# EAGLE design cytron (EAGLE 9.3.1)
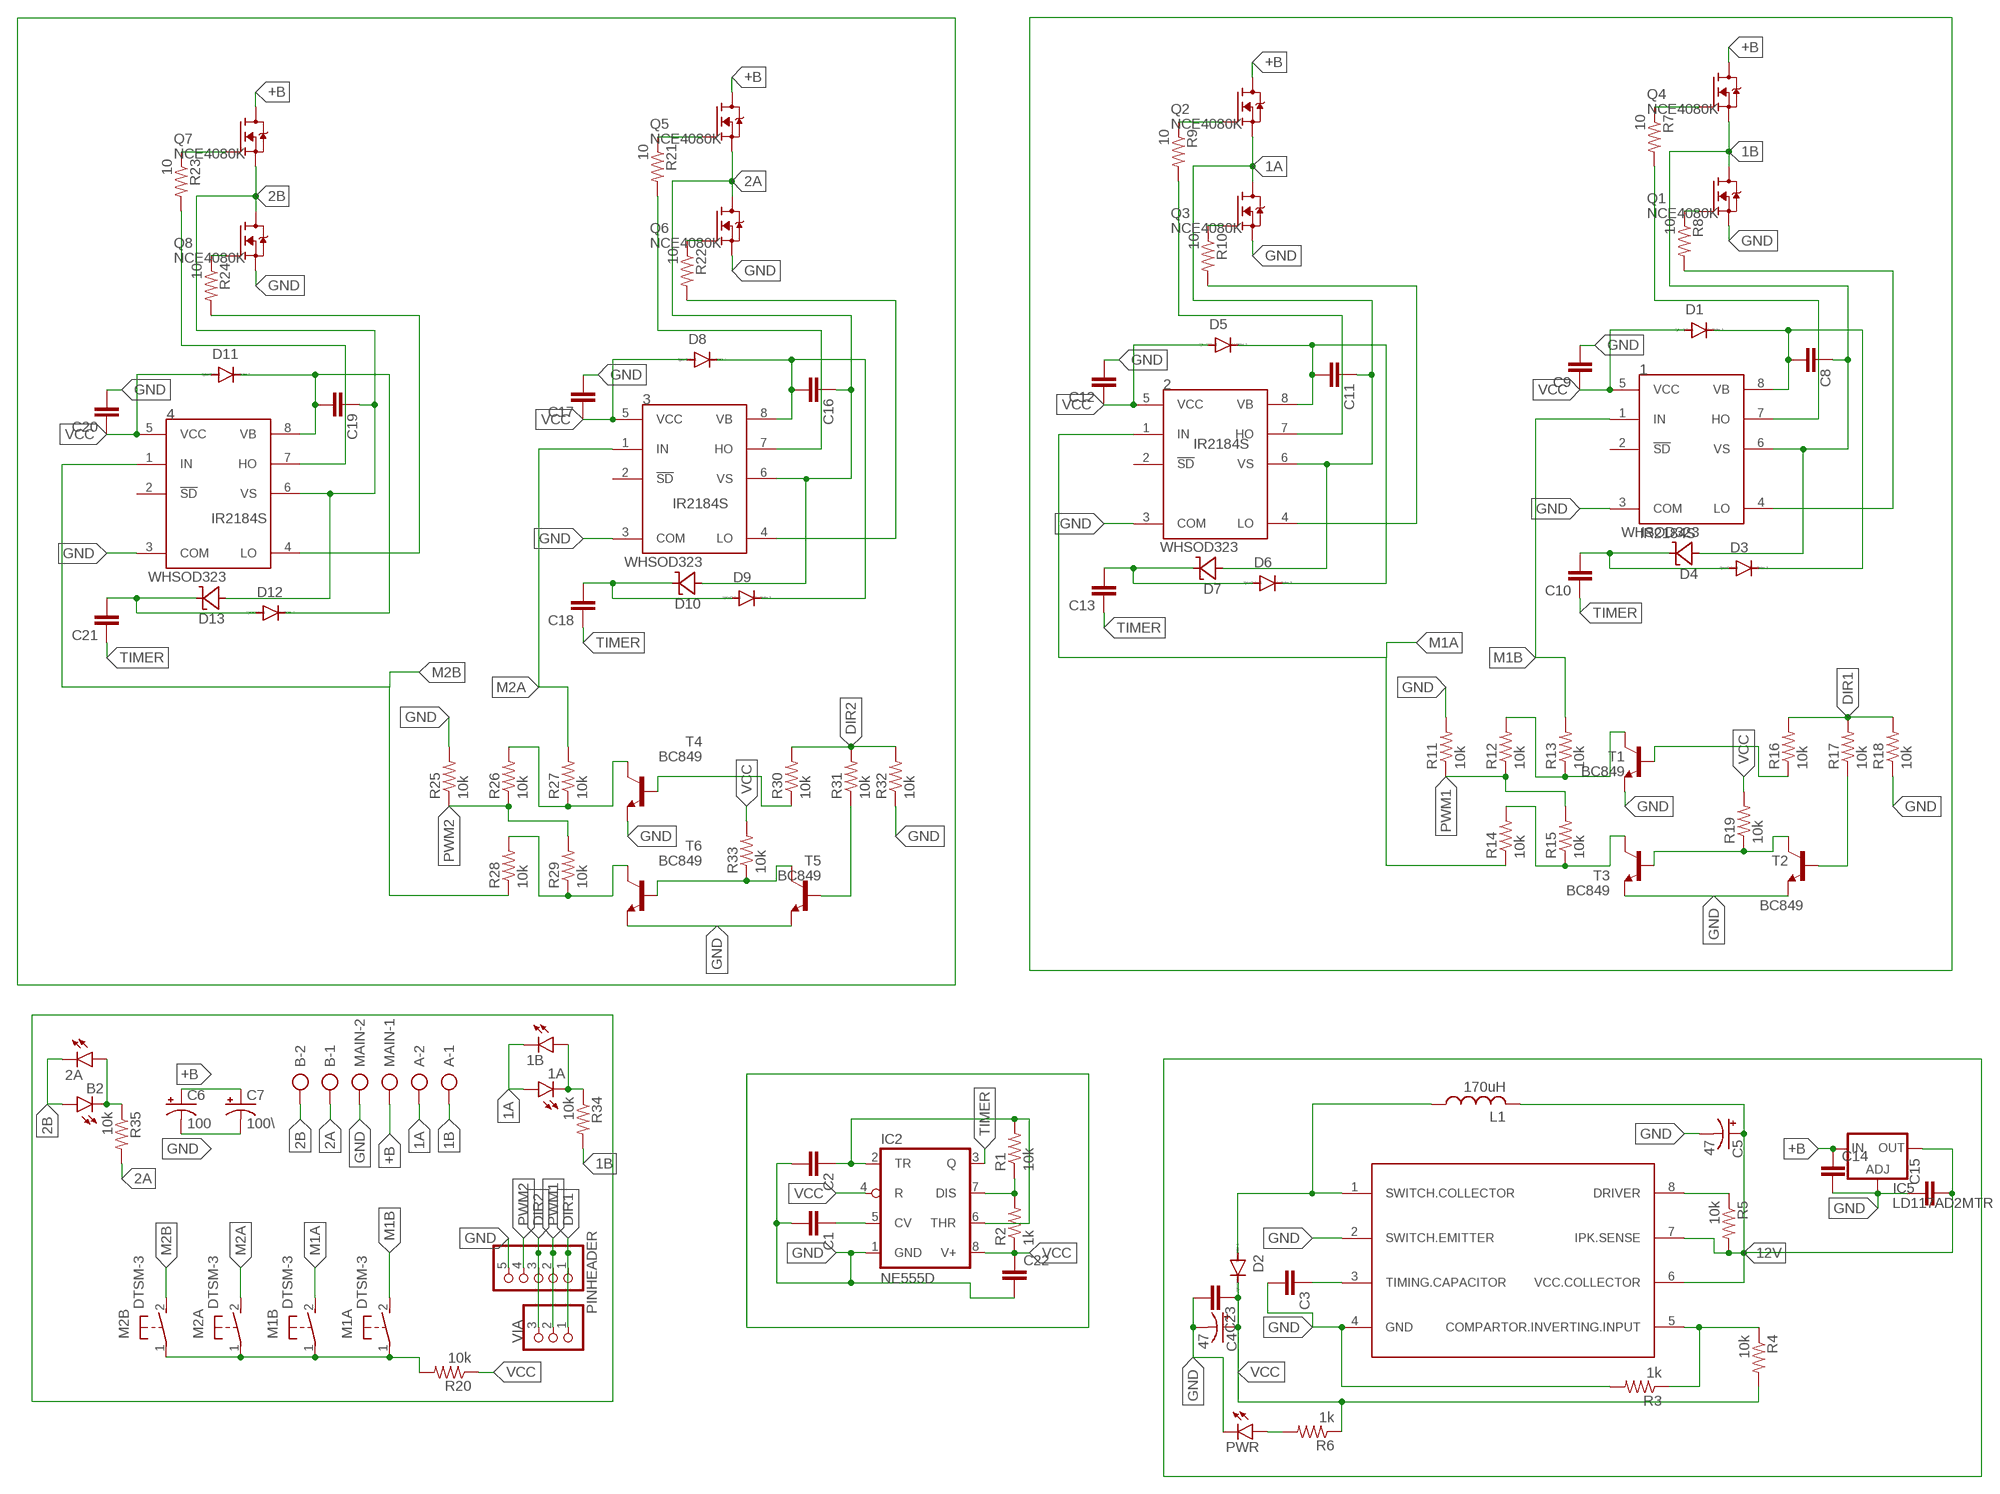
[diagram p0: schematic, sheet 1]

## Parts
1  IR2184S  [SO08]
1A  LEDCHIPLED_1206  [CHIPLED_1206]
1B  LEDCHIPLED_1206  [CHIPLED_1206]
2  IR2184S  [SO08]
2A  LEDCHIPLED_1206  [CHIPLED_1206]
3  IR2184S  [SO08]
4  IR2184S  [SO08]
A  AK300/22  [XTALRR488W60L1090T465H350B]
B  AK300/22  [XTALRR488W60L1090T465H350B]
B2  LEDCHIPLED_1206  [CHIPLED_1206]
C1  C-EUC0805K  [C0805K]
C2  C-EUC0805K  [C0805K]
C3  C-EUC0805K  [C0805K]
C4  47  CPOL-US140CLH-1014  [140CLH-1014]
C5  47  CPOL-US140CLH-1014  [140CLH-1014]
C6  100  CPOL-USSANYO_SMD_F12  [SANYO-OSCON_SMD_F12]
C7  100\  CPOL-USSANYO_SMD_F12  [SANYO-OSCON_SMD_F12]
C8  C-EUC0805K  [C0805K]
C9  C-EUC0805K  [C0805K]
C10  C-EUC0805K  [C0805K]
C11  C-EUC0805K  [C0805K]
C12  C-EUC0805K  [C0805K]
C13  C-EUC0805K  [C0805K]
C14  C-EUC0805K  [C0805K]
C15  C-EUC0805K  [C0805K]
C16  C-EUC0805K  [C0805K]
C17  C-EUC0805K  [C0805K]
C18  C-EUC0805K  [C0805K]
C19  C-EUC0805K  [C0805K]
C20  C-EUC0805K  [C0805K]
C21  C-EUC0805K  [C0805K]
C22  C-EUC0805K  [C0805K]
C23  C-EUC0805K  [C0805K]
D1  DIODE-SMB  [SMB]
D2  DIODE-SMB  [SMB]
D3  DIODE-SMB  [SMB]
D4  WHSOD323  [SOD323-W]
D5  DIODE-SMB  [SMB]
D6  DIODE-SMB  [SMB]
D7  WHSOD323  [SOD323-W]
D8  DIODE-SMB  [SMB]
D9  DIODE-SMB  [SMB]
D10  WHSOD323  [SOD323-W]
D11  DIODE-SMB  [SMB]
D12  DIODE-SMB  [SMB]
D13  WHSOD323  [SOD323-W]
IC2  NE555D  [SO08]
IC5  LD117AD2MTR  [D2PACK]
L1  170uH  L-USWE-TPC  [POWER-CHOKE_WE-TPC]
M1A  DTSM-3  [DTSM-3]
M1B  DTSM-3  [DTSM-3]
M2A  DTSM-3  [DTSM-3]
M2B  DTSM-3  [DTSM-3]
MAIN  AK300/22  [XTALRR488W60L1090T465H350B]
PINHEADER  PINHD-1X5  [1X05]
PWR  LEDCHIPLED_1206  [CHIPLED_1206]
Q1  NCE4080K  [TO252]
Q2  NCE4080K  [TO252]
Q3  NCE4080K  [TO252]
Q4  NCE4080K  [TO252]
Q5  NCE4080K  [TO252]
Q6  NCE4080K  [TO252]
Q7  NCE4080K  [TO252]
Q8  NCE4080K  [TO252]
R1  10k  R-US_R1206  [R1206]
R2  1k  R-US_R1206  [R1206]
R3  1k  R-US_R1206  [R1206]
R4  10k  R-US_R1206  [R1206]
R5  10k  R-US_R1206  [R1206]
R6  1k  R-US_R1206  [R1206]
R7  10  R-US_R1206  [R1206]
R8  10  R-US_R1206  [R1206]
R9  10  R-US_R1206  [R1206]
R10  10  R-US_R1206  [R1206]
R11  10k  R-US_R1206  [R1206]
R12  10k  R-US_R1206  [R1206]
R13  10k  R-US_R1206  [R1206]
R14  10k  R-US_R1206  [R1206]
R15  10k  R-US_R1206  [R1206]
R16  10k  R-US_R1206  [R1206]
R17  10k  R-US_R1206  [R1206]
R18  10k  R-US_R1206  [R1206]
R19  10k  R-US_R1206  [R1206]
R20  10k  R-US_R1206  [R1206]
R21  10  R-US_R1206  [R1206]
R22  10  R-US_R1206  [R1206]
R23  10  R-US_R1206  [R1206]
R24  10  R-US_R1206  [R1206]
R25  10k  R-US_R1206  [R1206]
R26  10k  R-US_R1206  [R1206]
R27  10k  R-US_R1206  [R1206]
R28  10k  R-US_R1206  [R1206]
R29  10k  R-US_R1206  [R1206]
R30  10k  R-US_R1206  [R1206]
R31  10k  R-US_R1206  [R1206]
R32  10k  R-US_R1206  [R1206]
R33  10k  R-US_R1206  [R1206]
R34  10k  R-US_R1206  [R1206]
R35  10k  R-US_R1206  [R1206]
T1  BC849  [SOT23]
T2  BC849  [SOT23]
T3  BC849  [SOT23]
T4  BC849  [SOT23]
T5  BC849  [SOT23]
T6  BC849  [SOT23]
U$1  AB34063  [SO8]
VIA  PINHD-1X3  [1X03]

## Nets
1A: 1A.A 1B.C 2.6(VS) A.2 C11.1 D7.A Q2.2(S) Q3.3(D)
1B: 1.6(VS) A.1 C8.1 D4.A Q1.3(D) Q4.2(S) R34.2
2A: 3.6(VS) B.1 C16.1 D10.A Q5.2(S) Q6.3(D) R35.2
2B: 2A.C 4.6(VS) B2.A B.2 C19.1 D13.A Q7.2(S) Q8.3(D)
12V: C5.+ C15.2 IC5.3(OUT) L1.2 R5.2 U$1.6(VCC.COLLECTOR) U$1.7(IPK.SENSE)
+B: C6.+ C7.+ C14.1 IC5.1(IN) MAIN.1 Q2.3(D) Q4.3(D) Q5.3(D) Q7.3(D)
DIR1: PINHEADER.1 R16.2 R17.2 R18.2 VIA.1
DIR2: PINHEADER.3 R30.2 R31.2 R32.2 VIA.3
GND: 1.3(COM) 2.3(COM) 3.3(COM) 4.3(COM) C1.2 C2.2 C3.2 C4.- C5.- C6.- C7.- C9.2 C12.2 C14.2 C15.1 C17.2 C20.2 C22.2 C23.2 IC2.1(GND) IC5.2(ADJ) MAIN.2 PINHEADER.5 PWR.C Q1.2(S) Q3.2(S) Q6.2(S) Q8.2(S) R3.2 R11.2 R18.1 R25.2 R32.1 T1.2(E) T2.2(E) T3.2(E) T4.2(E) T5.2(E) T6.2(E) U$1.2(SWITCH.EMITTER) U$1.4(GND)
M1A: 2.1(IN) M1B.2 R14.1
M1B: 1.1(IN) M1A.2 R13.2
M2A: 3.1(IN) M2A.2 R27.2
M2B: 4.1(IN) M2B.2 R28.1
N$1: PWR.A R6.2
N$2: C1.1 IC2.5(CV)
N$3: IC2.7(DIS) R1.1 R2.2
N$4: C2.1 IC2.2(TR) IC2.6(THR) R1.2
N$5: C3.1 U$1.3(TIMING.CAPACITOR)
N$6: Q6.1(G) R22.1
N$7: D2.A L1.1 U$1.1(SWITCH.COLLECTOR)
N$8: R5.1 U$1.8(DRIVER)
N$9: Q4.1(G) R7.1
N$10: Q1.1(G) R8.1
N$11: R3.1 R4.1 U$1.5(COMPARTOR.INVERTING.INPUT)
N$12: 1.4(LO) R8.2
N$13: 1.7(HO) R7.2
N$14: C10.2 D3.A D4.C
N$15: Q3.1(G) R10.1
N$16: Q2.1(G) R9.1
N$17: 2.4(LO) R10.2
N$18: 2.7(HO) R9.2
N$19: R16.1 T1.1(B)
N$20: C13.2 D6.A D7.C
N$21: M1A.1 M1B.1 M2A.1 M2B.1 R20.2
N$22: R14.2 R15.1 T3.3(C)
N$24: R12.2 R13.1 T1.3(C)
N$25: Q5.1(G) R21.1
N$26: 3.4(LO) R22.2
N$27: R19.1 T2.3(C) T3.1(B)
N$28: R17.1 T2.1(B)
N$30: 3.7(HO) R21.2
N$31: C18.2 D9.A D10.C
N$32: Q8.1(G) R24.1
N$33: Q7.1(G) R23.1
N$34: 4.4(LO) R24.2
N$35: 4.7(HO) R23.2
N$36: C21.2 D12.A D13.C
N$37: R28.2 R29.1 T6.3(C)
N$38: R26.2 R27.1 T4.3(C)
N$39: R30.1 T4.1(B)
N$40: R33.1 T5.3(C) T6.1(B)
N$41: R31.1 T5.1(B)
N$45: 1A.C 1B.A R34.1
N$46: 2A.A B2.C R35.1
PWM1: PINHEADER.2 R11.1 R12.1 R15.2 VIA.2
PWM2: PINHEADER.4 R25.1 R26.1 R29.2
TIMER: C10.1 C13.1 C18.1 C21.1 IC2.3(Q)
VB1: 1.8(VB) C8.2 D1.C D3.C
VB2: 2.8(VB) C11.2 D5.C D6.C
VB3: 3.8(VB) C16.2 D8.C D9.C
VB4: 4.8(VB) C19.2 D11.C D12.C
VCC: 1.5(VCC) 2.5(VCC) 3.5(VCC) 4.5(VCC) C4.+ C9.1 C12.1 C17.1 C20.1 C22.1 C23.1 D1.A D2.C D5.A D8.A D11.A IC2.4(R) IC2.8(V+) R2.1 R4.2 R6.1 R19.2 R20.1 R33.2
Unconnected: 1.2(!SD) 2.2(!SD) 3.2(!SD) 4.2(!SD)

## Library data of the parts
1-4 = irs:IR2184
1A 1B 2A B2 PWR = led:LED: LED OSRAM: - CHIPLED LG R971, LG N971, LY N971, LG Q971, LY Q971, LO R971, LY R971 LH N974, LH R974 LS Q976, LO Q976, LY Q976 LO Q996 - Hyper CHIPLED LW Q18S LB Q993, LB Q99A, LB R99A - SideLED LS A670, LO A670, LY A670, LG A670, LP A670 LB A673, LV A673, LT A673, LW A673 LH A674 LY A675 LS A676, LA A676, LO A676, LY A676, LW A676 LS A679, LY A679, LG A679 - Hyper Micro SIDELED® LS Y876, LA Y876, LO Y876, LY Y876 LT Y87S - SmartLED LW L88C, LW L88S LB L89C, LB L89S, LG L890 LS L89K, LO L89K, LY L89K LS L896, LA L896, LO L896, LY L896 - TOPLED LS T670, LO T670, LY T670, LG T670, LP T670 LSG T670, LSP T670, LSY T670, LOP T670, LYG T670 LG T671, LOG T671, LSG T671 LB T673, LV T673, LT T673, LW T673 LH T674 LS T676, LA T676, LO T676, LY T676, LB T676, LH T676, LSB T676, LW T676 LB T67C, LV T67C, LT T67C, LS T67K, LO T67K, LY T67K, LW E67C LS E67B, LA E67B, LO E67B, LY E67B, LB E67C, LV E67C, LT E67C LW T67C LS T679, LY T679, LG T679 LS T770, LO T770, LY T770, LG T770, LP T770 LB T773, LV T773, LT T773, LW T773 LH T774 LS E675, LA E675, LY E675, LS T675 LS T776, LA T776, LO T776, LY T776, LB T776 LHGB T686 LT T68C, LB T68C - Hyper Mini TOPLED® LB M676 - Mini TOPLED Santana® LG M470 LS M47K, LO M47K, LY M47K Source: http://www.osram.convergy.de LUXEON: - LUMILED® LXK2-PW12-R00, LXK2-PW12-S00, LXK2-PW14-U00, LXK2-PW14-V00 LXK2-PM12-R00, LXK2-PM12-S00, LXK2-PM14-U00 LXK2-PE12-Q00, LXK2-PE12-R00, LXK2-PE12-S00, LXK2-PE14-T00, LXK2-PE14-U00 LXK2-PB12-K00, LXK2-PB12-L00, LXK2-PB12-M00, LXK2-PB14-N00, LXK2-PB14-P00, LXK2-PB14-Q00 LXK2-PR12-L00, LXK2-PR12-M00, LXK2-PR14-Q00, LXK2-PR14-R00 LXK2-PD12-Q00, LXK2-PD12-R00, LXK2-PD12-S00 LXK2-PH12-R00, LXK2-PH12-S00 LXK2-PL12-P00, LXK2-PL12-Q00, LXK2-PL12-R00 Source: www.luxeon.com KINGBRIGHT: KA-3528ASYC Source: www.kingbright.com
A B MAIN = con-ptr50056:AK300/2: CONNECTOR
C1-C3 C8-C23 = rcl:C-EU: CAPACITOR, European symbol; SPICEPREFIX: C
C4-C7 = rcl:CPOL-US: POLARIZED CAPACITOR, American symbol; SPICEPREFIX: C
D1-D3 D5 D6 D8 D9 D11 D12 = diode:DIODE-: DIODE
D4 D7 D10 D13 = diode:WH
IC2 = linear:*555: TIMER
IC5 = v-reg:LD117A?*: Low drop fixed and adjustable positive voltage regulators 1 A Source: http://www.st.com/stonline/products/literature/ds/7194/ld1117axx.pdf
L1 = rcl:L-US: INDUCTOR, American symbol; SPICEPREFIX: L
M1A M1B M2A M2B = switch-tact:DTSM-3
PINHEADER = pinhead:PINHD-1X5: PIN HEADER
Q1-Q8 = transistor-fet:NCE4080K
R1-R35 = rcl:R-US_: RESISTOR, American symbol; SPICEPREFIX: R
T1-T6 = transistor-neu-to92:BC849: NPN TRANSISTOR
U$1 = ab34063:AB34063
VIA = pinhead:PINHD-1X3: PIN HEADER

## Board
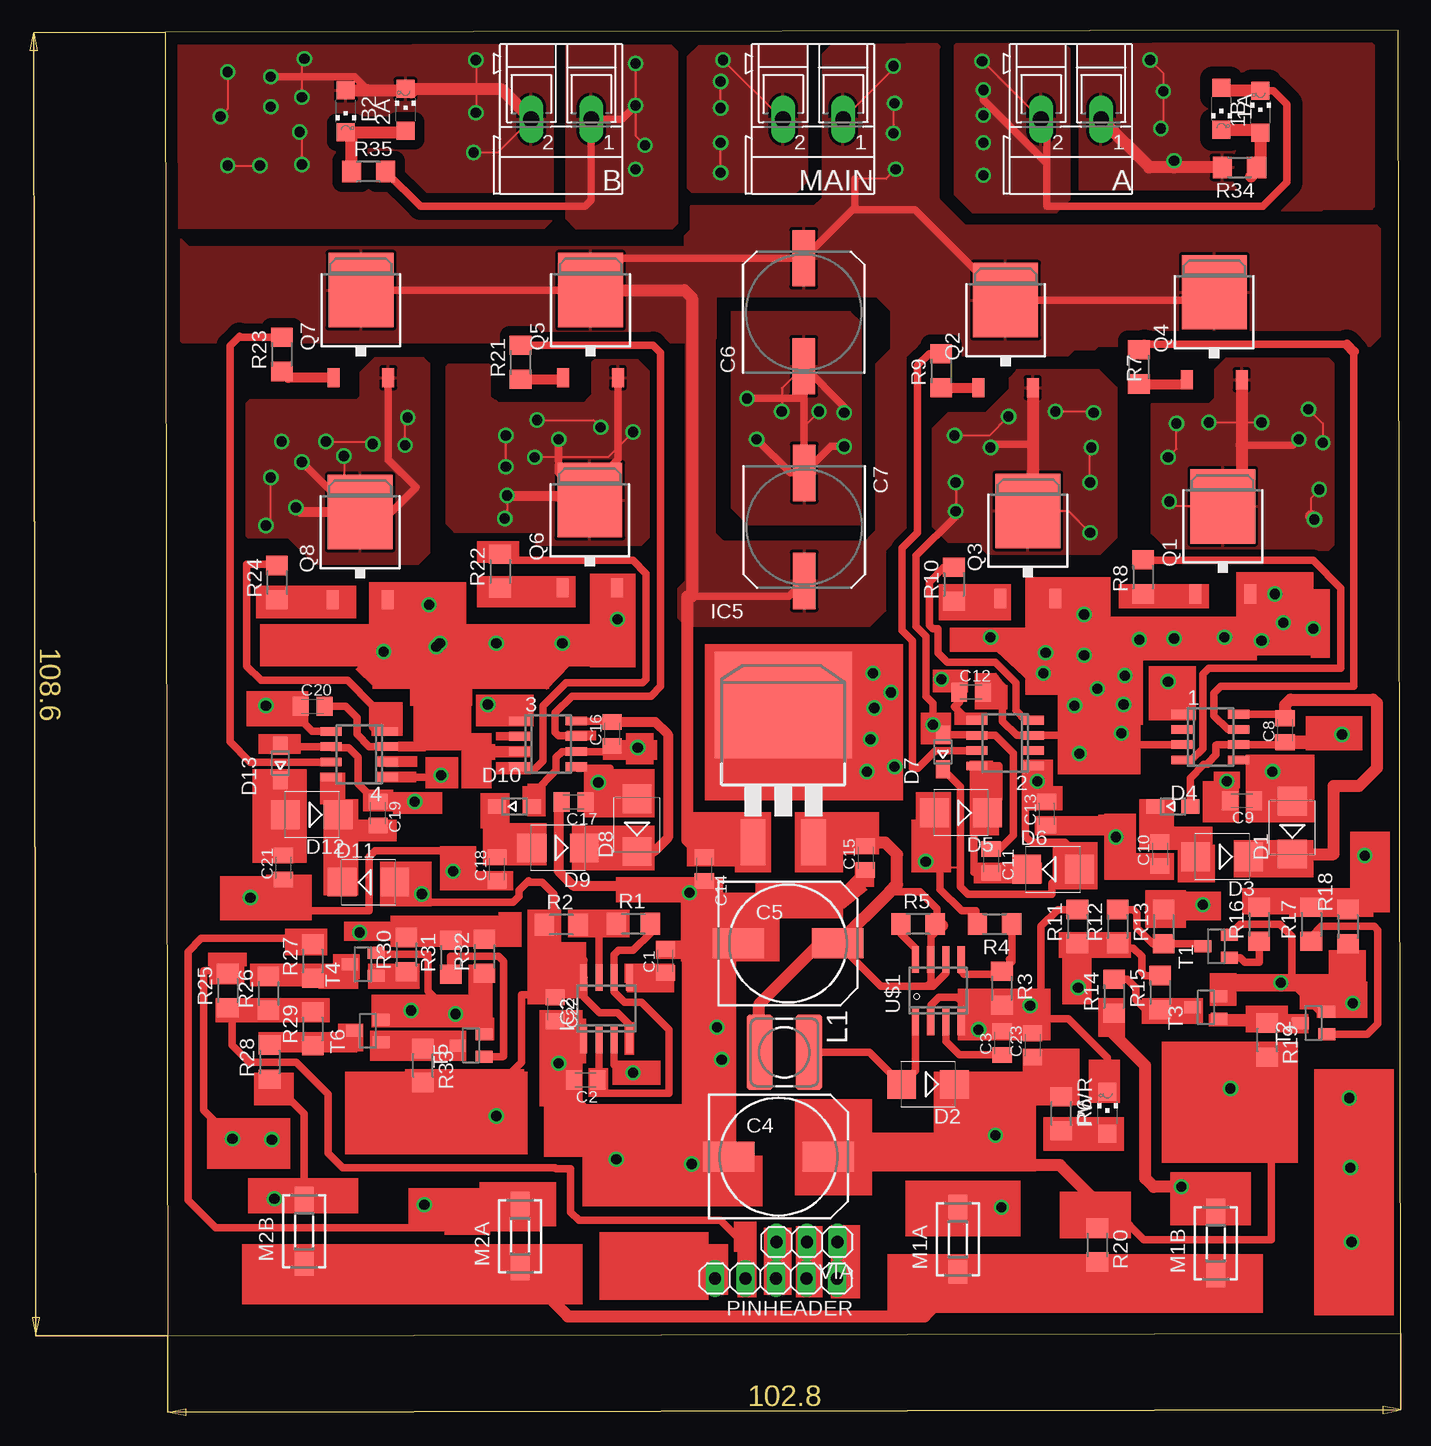
[diagram p1: board, top side]
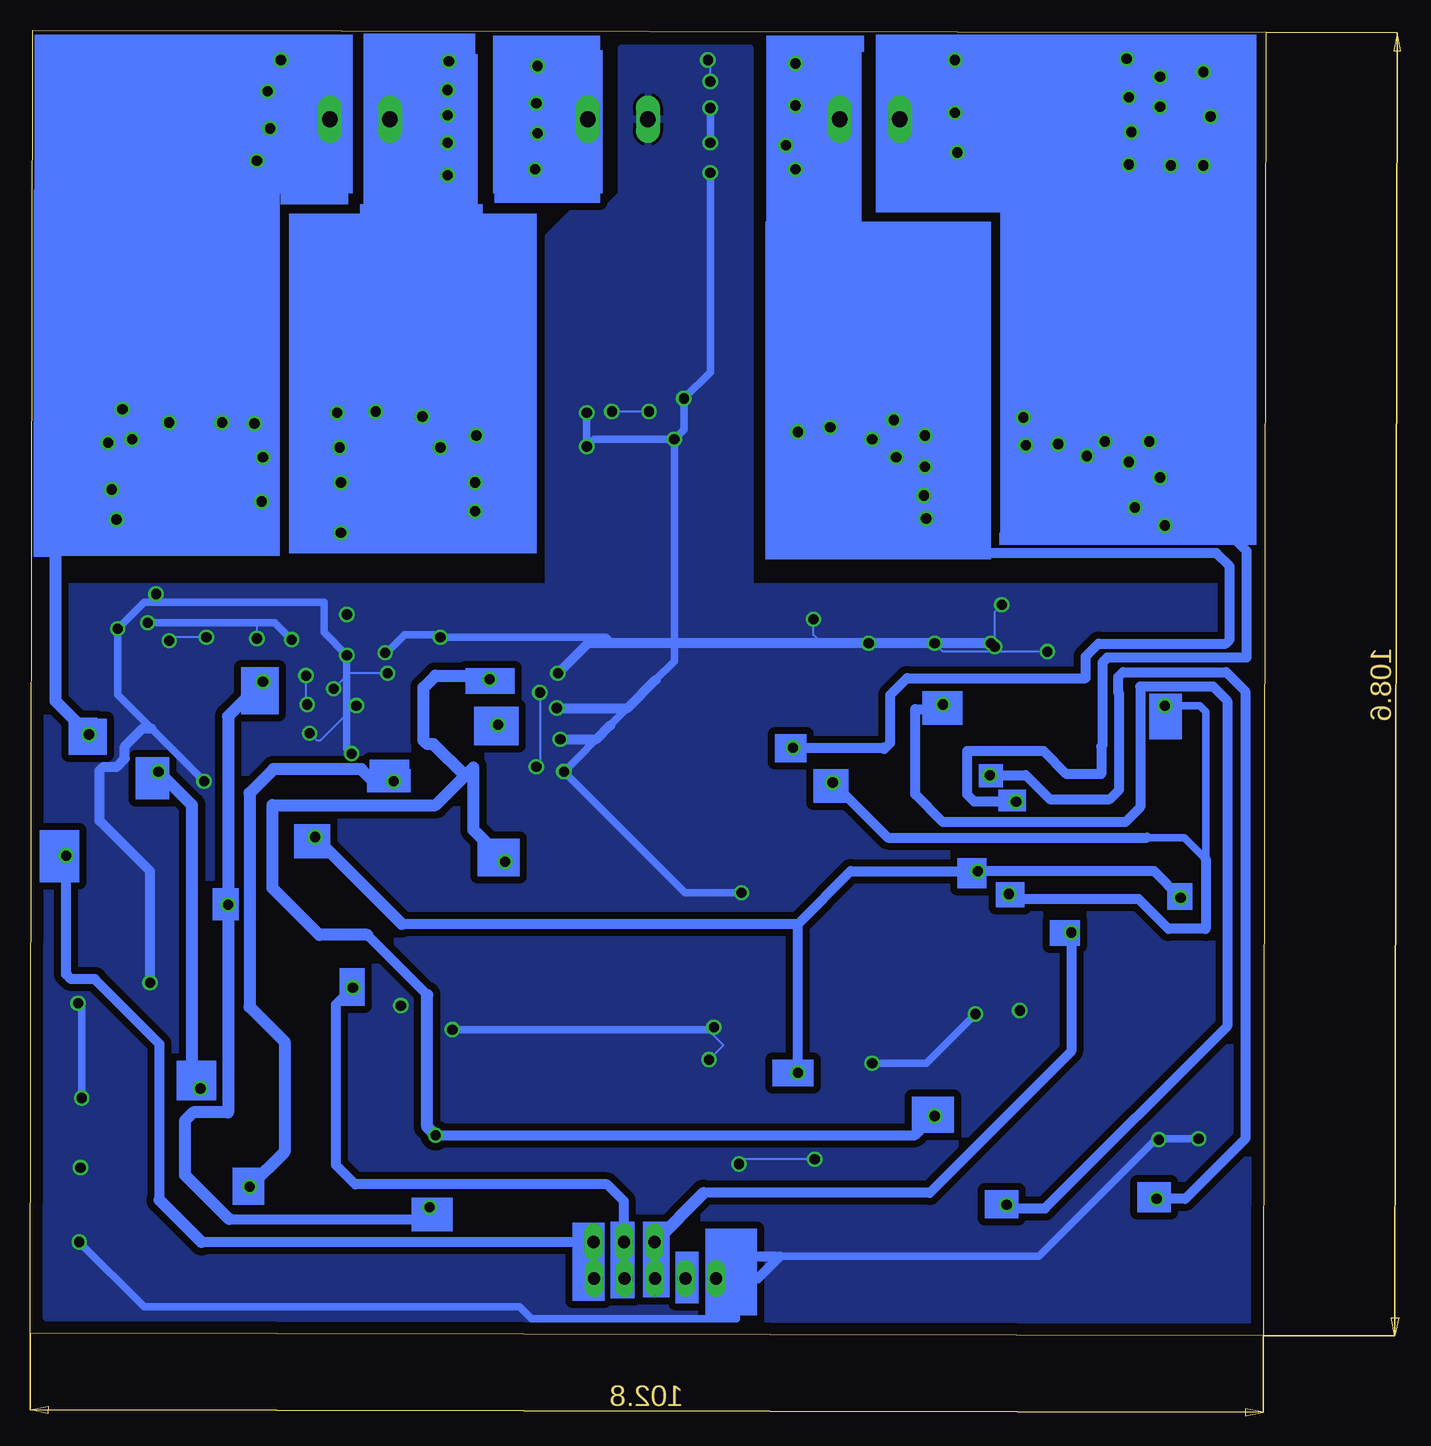
[diagram p2: board, bottom side, seen from below]

Size 103 x 108.8 mm. Coordinates in mm from the lower left corner, seen from the top.
Outline: 0.2,0 103,0.2 102.8,108.8 0,108.6 0.2,0
Copper layers (1*16): Top 0.035mm / dielectric 1.5mm / Bottom 0.035mm
Design rules "default *": minimum track width 0.015240625mm, minimum drill 0.8mm, track to track 0.6mm, track to pad 0.6mm, pad to pad 0.6mm, via to via 6mil, smd to smd 6mil, copper to edge 40mil, drill to drill 6mil, minimum pad ring 10mil, minimum via ring 8mil, stop-mask expansion 4mil, vias tented up to drill 0mil, thermal gap 10mil

### Footprints (pad centres in the part's own frame; a part is rotated, then mirrored left to right if it is on the bottom)
SO08 = smd 0.72 x 1.78: 1 -1.905,-2.35; 2 -0.635,-2.35; 3 0.635,-2.35; 4 1.905,-2.35; 5 1.905,2.35; 6 0.635,2.35; 7 -0.635,2.35; 8 -1.905,2.35
CHIPLED_1206 = smd 1.5 x 1.5: A 0,-1.75; C 0,1.75
XTALRR488W60L1090T465H350B = drill 1.321 long: 1 -2.515,-1.27; 2 2.489,-1.27
C0805K = smd 1.3 x 1.6: 1 -1,0; 2 1,0
140CLH-1014 = smd 4.3 x 2.5: + 4.15,0; - -4.15,0
SANYO-OSCON_SMD_F12 = smd 4.7 x 1.9: + 4.5,0; - -4.5,0
SMB = smd 2.4 x 2.4: A 2.2,0; C -2.2,0
SOD323-W = smd 1.5 x 1.2: A 1.45,0; C -1.45,0
SO08' = smd 0.6 x 2.2: 1 -1.905,-2.6; 2 -0.635,-2.6; 3 0.635,-2.6; 4 1.905,-2.6; 5 1.905,2.6; 6 0.635,2.6; 7 -0.635,2.6; 8 -1.905,2.6
D2PACK = smd 2.083 x 3.81: 1 -2.54,-8.89; 3 2.54,-8.89 | smd 11.43 x 8.89: 2 0,2.54
POWER-CHOKE_WE-TPC = smd 6.3 x 2.2: 1 0,2.05; 2 0,-2.05
DTSM-3 = smd 2 x 1.6: 1 -2.7,0; 2 2.7,0
1X05 = drill 1.016 long: 1 -5.08,0; 2 -2.54,0; 3 0,0; 4 2.54,0; 5 5.08,0
TO252 = smd 1 x 1.6: 1 -2.28,-4.8; 2 2.28,-4.8 | smd 5.4 x 6.2: 3 0,2.5
R1206 = smd 1.6 x 1.803: 1 -1.422,0; 2 1.422,0
SOT23 = smd 1 x 1.4: 1 -0.95,-1.1; 2 0.95,-1.1; 3 0,1.1
SO8 = smd 0.6 x 2.2: 1 -1.905,-2.6; 2 -0.635,-2.6; 3 0.635,-2.6; 4 1.905,-2.6; 5 1.905,2.6; 6 0.635,2.6; 7 -0.635,2.6; 8 -1.905,2.6
1X03 = drill 1.016 long: 1 -2.54,0; 2 0,0; 3 2.54,0

### Placement (x,y rotation side)
1  87.13,49.88 270 top
1A  88.05,102.23 180 top
1B  91.3,101.97 0 top
2  70.01,49.38 90 top
2A  20.03,102.15 0 top
3  31.92,49.31 270 top
4  16.18,48.45 90 top
A  75.5,100.1 180 top
B  33,100.1 180 top
B2  15.05,102.05 180 top
C1  41.7,31.23 90 top
C2  35.05,21.3 180 top
C3  69.77,24.39 90 top
C4  51.12,14.91 0 top
C5  51.92,32.68 0 top
C6  53.23,85.28 90 top
C7  53.27,67.39 270 top
C8  93.36,50.45 90 top
C9  89.75,44.57 180 top
C10  82.92,40.14 90 top
C11  68.86,39.55 270 top
C12  67.19,53.62 0 top
C13  73.48,43.5 90 top
C14  44.93,38.89 270 top
C15  58.38,39.81 90 top
C16  37.26,50.15 90 top
C17  34.04,44.46 180 top
C18  27.66,38.87 90 top
C19  17.74,43.52 270 top
C20  12.29,52.44 0 top
C21  9.86,39 90 top
C22  32.5,27.2 270 top
C23  72.3,24.2 90 top
D1  93.96,42.33 90 top
D2  63.59,20.93 180 top
D3  88.1,39.9 180 top
D4  84.01,44.1 0 top
D5  66.33,43.57 180 top
D6  74.01,38.87 0 top
D7  64.83,48.64 90 top
D8  39.34,42.54 90 top
D9  32.73,40.64 180 top
D10  29.12,44.1 0 top
D11  16.95,37.8 0 top
D12  12.22,43.4 180 top
D13  9.6,47.71 90 top
IC2  NE555D  [SO08']  36.79,27.25 0 top
IC5  51.52,50 0 top
L1  51.61,23.6 270 top
M1A  66.07,8.02 90 top
M1B  87.57,7.71 90 top
M2A  29.57,8.3 90 top
M2B  11.57,8.69 90 top
MAIN  54,100.1 180 top
PINHEADER  50.91,4.76 180 top
PWR  78.55,18.59 0 top
Q1  88.16,66.6 0 top
Q2  70.05,83.79 0 top
Q3  71.92,66.23 0 top
Q4  87.45,84.45 0 top
Q5  35.46,84.62 0 top
Q6  35.39,67.12 0 top
Q7  16.32,84.62 0 top
Q8  16.25,66.12 0 top
R1  39.02,34.32 0 top
R2  33.02,34.24 0 top
R3  69.75,28.94 270 top
R4  69.14,34.3 180 top
R5  62.76,34.3 0 top
R6  74.69,18.49 270 top
R7  81.16,80.72 90 top
R8  81.51,63.22 90 top
R9  64.69,80.41 90 top
R10  65.75,62.61 90 top
R11  76.04,34.08 90 top
R12  79.39,34.08 90 top
R13  83.24,34.08 90 top
R14  79.09,28.28 90 top
R15  82.94,28.58 90 top
R16  91.19,34.28 90 top
R17  95.54,34.28 90 top
R18  98.59,34.08 90 top
R19  91.86,24.62 270 top
R20  77.71,7.55 270 top
R21  29.62,81.11 90 top
R22  27.92,63.69 90 top
R23  9.72,81.77 90 top
R24  9.32,62.75 90 top
R25  5.21,28.75 90 top
R26  8.61,28.53 90 top
R27  12.31,31.21 90 top
R28  8.71,22.79 90 top
R29  12.31,25.57 90 top
R30  20.11,31.75 90 top
R31  23.81,31.53 90 top
R32  26.61,31.61 90 top
R33  21.49,22.51 270 top
R34  89.55,97.35 180 top
R35  16.95,97 0 top
T1  87.61,32.45 90 top
T2  95.73,26.05 90 top
T3  86.75,27.35 90 top
T4  16.49,30.95 90 top
T5  25.49,24.17 90 top
T6  16.89,25.39 90 top
U$1  64.45,28.75 0 top
VIA  53.5,7.8 180 top

### Tracks (layer width: path | path; a pad name or v marks a point on that pad's centre or on a via)
1A  (via drill 0.85)
  Top 0.152: Q3.3 75.27,68.73 v77.1,66.9 | v77.1,71.1 77.1,73.9 v77.2,74 | v77.4,76.9 77.3,77 v74.2,77 | v70.3,76.6 68.7,75 v65.8,75 | v65.9,71.1 v65.9,68.7 | A.2 68.18,106.2 v68.1,106.2
  Top 0.61: 1B.C 92.38,103.72 93.5,102.6 93.5,96.1 91.5,94.1 73.5,94.1 73.5,97.7 | 73.5,97.7 73.5,100.88 A.2 | D7.A 67.58,50.09 2.6 69.2,50.02 70.7,48.52 70.7,41.7 69.55,40.55 C11.1 | 73.5,97.7 68.2,103 v68.2,103.8 | v68.8,74 69.1,74.3 72.33,74.3 | v64,50.9 64,52.7 63.4,53.3 63.4,58.3 62.6,59.1 62.6,65 65.9,68.3 v65.9,68.7
  Top 1.016: 1B.C 88.31,103.72 1A.A | Q2.2 72.33,74.3 72.33,69.93 71,68.6 | 71,68.6 70,68.6 | 71,68.6 71.79,68.6 Q3.3 | D7.A 64.81,50.09 v64,50.9
  Bottom 0.152: v77.1,66.9 v77.1,71.1 | v77.2,74 77.2,76.7 v77.4,76.9 | v74.2,77 70.7,77 v70.3,76.6 | v65.8,75 65.8,71.2 v65.9,71.1 | v68.1,106.2 68.1,101.8 v68.2,101.7 v68.2,99.4 v68.2,96.7
  Bottom 0.61: v68.2,103.8 v68.2,101.7 | v68.2,96.7 68.2,74.6 v68.8,74
  pour Top: 65.8,107.5 65.8,95.1 67.3,93.6 74.3,93.6 75.4,94.7 75.4,107.2 74.8,107.8 66.1,107.8
  pour Top: 71,80.5 77.8,80.5 79.3,79 79.3,66.5 77.9,65.1 68.6,65.1 68.1,65.6 68.1,66.1 65.3,66.1 64,67.4 64,75.6 65.3,76.9 68.4,76.9 70.4,78.9 70.4,79.8 71,80.4
1B  (via drill 0.85)
  Top 0.152: Q1.3 84.1,69.1 v83.7,69.5 | v83.6,73.2 84.3,73.9 v84.3,76 | v87,76.1 v91.4,76.1 | v95.3,77.2 96.5,76 v96.5,74.4 | v96.2,70.5 95.5,69.8 95.5,68.3 | v82.1,106.3 83.2,105.2 v83.2,103.7 83.2,100.8 v83,100.6
  Top 0.61: C8.1 93.16,49.25 1.6 87.64,49.25 87.6,49.2 87.6,48.4 86.9,47.7 86.9,47.6 86.6,47.6 85.46,46.46 D4.A | 84.1,97.35 v84.1,97.9 | v94.5,74.7 94,74.2 89.73,74.2
  Top 1.016: R34.2 84.1,97.35 82.03,97.35 A.1 | Q4.2 89.73,74.2 89.73,70.67 Q1.3 | 95.5,68.3 v95.8,68 | v98.1,50.1 97.5,49.5 93.41,49.5 C8.1
  Bottom 0.152: v83.7,69.5 83.6,69.6 v83.6,73.2 | v84.3,76 84.4,76.1 v87,76.1 | v91.4,76.1 94.2,76.1 v95.3,77.2 | v96.5,74.4 96.2,74.1 v96.2,70.5 | A.1 82.1,105.45 v82.1,106.3 | v83,100.6 84.1,99.5 v84.1,97.9
  Bottom 0.61: v83.2,103.7 90.6,96.3 96,96.3 96,76.2 v94.5,74.7
  Bottom 1.016: v95.8,68 96.9,66.9 100.3,66.9 100.9,66.3 100.9,52.9 v98.1,50.1
  pour Top (isolate 1.016): 76.2,107.6 76.2,94.5 76.9,93.8 96.4,93.8 96.5,93.9 100.6,93.9 100.8,94.1 100.8,107.5 100.2,108.1 76.7,108.1
  pour Top: 82.2,77.6 82.2,66.9 83,66.1 83.6,65.5 93.6,65.5 97,65.5 97.4,65.9 97.4,81 97,81.4 90.9,81.4 88.4,81.4 87.9,80.9 87.5,80.5 87.5,78.1 87,77.6
2A  (via drill 0.85)
  Top 0.152: v39.2,106 39.2,100 v40,99.2 | v28.5,70 28.5,68.3 v28.3,68.1 | v28.4,72.4 v28.4,75 | v31,76.3 35.7,76.3 v36.3,75.7 | v39,75.3 36.9,73.2 v30.8,73.2
  Top 0.61: R35.2 21.27,94.1 35,94.1 35.52,94.61 B.1 38.07,101.37 v39.2,102.5 | C16.1 36.78,48.68 3.6 33.08,48.68 32.6,48.2 32.6,47.1 30.8,45.3 30.57,45.3 D10.A | Q5.2 37.74,73.04 35.39,70.69 35.39,70 | 35.39,70 Q6.3 | v32.8,74.7 32.8,71.9 34.8,69.9 34.9,70 35.39,70
  Top 0.813: C16.1 39.25,49.15 v39.4,49 | v28.5,70 35.39,70
  Bottom 0.152: v39.2,102.5 v39.2,106 | v40,99.2 40,98 39.3,97.3 39.3,94.7 39.2,94.6 | v28.3,68.1 28.3,72.3 v28.4,72.4 | v28.4,75 29.7,76.3 v31,76.3 | v36.3,75.7 36.7,75.3 v39,75.3 | v30.8,73.2 30.8,72 32.8,70
  Bottom 0.61: 39.2,94.6 39.2,81.1 v32.8,74.7
  Bottom 0.813: v32.8,74.7 32.8,70 32.8,65.6 32.4,65.2 4.1,65.2 3,64.1 3,58 3.33,57.66 13.94,57.66 15,56.6 15,54.8 29.9,54.8 31.3,53.4 31.3,49.4 31.8,48.9 31.9,49 v39.4,49
  other vias: 39.2,97.2
  pour Top (isolate 0.61): 33.4,107.6 33.4,93.1 34.2,92.3 42.3,92.3 42.7,92.7 42.7,107 42.2,107.5 33.5,107.5
  pour Top: 23.4,80.7 23.4,67.7 24,67.1 24.1,67 30.9,67 30.9,65.9 39.7,65.9 39.9,66.1 40.4,66.6 40.4,76.5 40.4,80.3 39.4,81.3 35.8,81.3 35.7,81.2 35.6,81.1 35.6,78.4 35.3,78.1 34.9,77.7 33.6,77.7 27.8,77.7 27.6,77.9 27.4,77.9 27.1,78.2 27.1,80.6 27.2,80.7 27,80.9 23.6,80.9
2B  (via drill 0.85)
  Top 0.152: v5.2,105.3 5.2,102.2 v4.6,101.6 | v5.2,97.5 v7.9,97.5 | v11.4,97.6 11.4,100.1 v11.2,100.3 | v11.4,103.2 11.4,106.2 v11.6,106.4 | v25.9,106.3 v25.9,101.9 | v25.7,98.6 27.74,98.6 B.2 | v8.4,67.5 8.8,67.9 v8.8,71.5 | v13.4,74.5 17.1,74.5 v17.3,74.3 | v20,74.2 20,76.3 v20.2,76.5 | v14.9,73.3 14.9,70.8 16.4,69.3 16.4,68.62
  Top 0.61: D13.A 9.68,49.09 4.6 13.91,49 15.3,49 16.1,48.2 16.1,46 17.58,44.52 C19.1 | Q7.2 18.6,73 20.9,70.7 18.82,68.62 16.4,68.62 Q8.3 15.58,68.62 v11.4,72.8 | 16.9,103.8 15.8,104.9 v8.8,104.9
  Top 0.813: C19.1 20.78,44.52 v20.8,44.5 | Q8.3 11.28,68.62 v10.9,69
  Top 1.016: B2.A 16.9,103.8 20.3,103.8 | 20.3,103.8 20.5,103.6 | 20.3,103.8 20.2,103.9 2A.C 27.98,103.9 B.2
  Bottom 0.152: v8.8,104.9 v8.8,102.4 5.9,105.3 v5.2,105.3 | v4.6,101.6 4.6,98.1 v5.2,97.5 | v7.9,97.5 11.3,97.5 v11.4,97.6 | v11.2,100.3 11.2,103 v11.4,103.2 | v11.6,106.4 25.8,106.4 v25.9,106.3 | v25.9,101.9 25.9,98.8 v25.7,98.6 | 8.4,69 v8.4,67.5 | v8.8,71.5 8.8,73.6 v9.7,74.5 v13.4,74.5 | v17.3,74.3 17.4,74.2 v20,74.2 | v20.2,76.5 18,74.3 18,73.9 19.5,73.9 20,74.4 | 20.1,74.5 20,74.4 | 20,74.4 17.1,74.4 16,73.3 v14.9,73.3
  Bottom 0.61: v8.8,102.4 8.8,75.4 v9.7,74.5 v11.4,72.8
  Bottom 0.813: v20.8,44.5 24.3,44.5 24.9,45.1 24.9,48.7 18.5,48.7 16.6,46.8 13.7,46.8 13.7,49.1 13.6,49.2 13.6,56.1 13.2,56.5 1.6,56.5 1.6,65.4 5.2,69 8.4,69 v10.9,69
  pour Top (isolate 0.813): 32.3,107.5 32.3,93 31.6,92.3 0.5,92.3 0.2,92.6 0.2,106.9 1.1,107.8 32,107.8
  pour Top: 21.1,64.3 12.5,64.3 12.4,64.4 10.3,66.5 9.5,66.5 6.9,66.5 6.8,66.6 6.8,67.4 6.8,77.1 6.8,77.7 7.1,78 16,78 16.3,78.3 16.3,80.3 17.5,81.5 19.6,81.5 21.5,81.5 22,81 22,65.2
12V
  Top 0.61: C5.+ 59.65,29.1 63.5,29.1 | 63.5,29.1 64,29.1 65.08,30.19 U$1.6 | 64.75,34.17 63.81,33.23 U$1.7 63.81,29.42 63.5,29.1 | 60.4,37.01 62.9,37.01 64.31,35.59 64.31,34.17 | C15.2 58.29,40.81 58,41.1
  Top 1.016: 58,41.1 60,41.1 61,40.1 61,37.61 60.4,37.01 C5.+ 54.58,32.68 49.5,27.6 49.5,23.66 L1.2 | IC5.3 58.08,41.11 C15.2 | 64.75,34.17 64.31,34.17 R5.2
+B  (via drill 0.85)
  Top 0.152: MAIN.1 60.7,105.55 v60.7,105.8 | v60.8,102.7 60.7,102.6 v60.7,100.2 | v60.9,97.2 60.1,96.4 57.5,96.4
  Top 0.61: 57.27,93.82 C6.+ 38.12,89.78 Q5.3 Q7.3 16.02,87.12 16,87.1 | 57.27,93.82 57.5,94.05 57.5,96.4 | 57.27,93.82 62.52,93.82 Q2.3 86.79,86.29 87.29,86.79 | 87.29,86.79 88.19,86.79 | 88.19,86.79 88.5,87.1 | 88.19,86.79 88,86.6 87,86.6 88,87.6 88,88.1 | 16,87.1 15.5,86.6 17.5,86.6 17.5,87.1 17,87.6 16,87.6 16,87.1 | Q4.3 87.29,86.79 | C7.+ 51.98,61.6 43.9,61.6 43.5,61.6 | IC5.1 47.76,39.89
  Top 1.016: 43.5,61.6 43.5,41.32 C14.1 47.76,39.89 | Q5.3 43.28,87.12 43.9,86.5 43.9,61.6
  Bottom 0.152: v60.7,105.8 60.7,102.8 v60.8,102.7 | v60.7,100.2 60.7,97.4 v60.9,97.2
  pour Top (isolate 0.813): 1.3,91.4 1.3,82.9 1.4,82.8 42.3,82.8 45.6,82.8 45.9,83.1 45.9,86.6 59.3,86.6 60.5,85.4 60.5,81.7 75.3,81.7 75.8,82.2 77.5,82.2 77.8,82.5 98.9,82.5 100.5,82.5 101.3,83.3 101.3,92.2 101,92.5 66.7,92.5 65.6,93.6 64.5,94.7 64.5,104.9 64.5,107.3 64.6,107.4 64,108 63.7,108 56,108 55,107 54.8,106.8 54.8,98.6 54.8,94.8 54.1,94.1 43.8,94.1 43.8,92.1 43.3,91.6 43.3,90.7 2,90.7
  pour Top: 45.8,83.5 45.8,67.7 45.8,66.9 46.5,66.2 58.4,66.2 58.8,66.6 59.3,67.1 59.3,68.3 59.3,81 60.5,82.2 61.6,82.2 61.7,82.1 61.7,67.1 60.6,66 60,65.4 60,63.9 60,60.4 58.7,59.1 43.5,59.1 42.8,59.8 42.8,62.3 43.4,62.9 43.4,83.7 43.5,83.8 43.9,84.2 45.5,84.2 45.8,83.9
DIR1  (via drill 0.85)
  Top 0.61: R16.2 R17.2 95.74,35.5 98.4,35.5 R18.2 | VIA.1 55.99,7.75 PINHEADER.1
  Top 1.016: v100,40 100,37.1 98.4,35.5
  Bottom 0.61: PINHEADER.1 56.1,4.87 56.1,7.8
  Bottom 0.813: VIA.1 56.1,7.8 88.7,7.8 | 92.2,11.3 92.2,24.3 97.6,29.7 99.6,29.7 100,30.1 v100,40
  Bottom 1.016: 88.7,7.8 92.2,11.3
DIR2  (via drill 0.85)
  Top 0.61: R32.2 26.53,32.95 R31.2 23.59,33.17 R30.2 19.68,33.6 v16.2,33.6
  Top 1.016: 27.55,32.95 26.53,32.95
  Bottom 0.61: VIA.3 50.96,4.81 PINHEADER.3
  Bottom 0.813: v16.2,33.6 16.2,23.7 28,11.9 46.86,11.9
  Bottom 1.016: 46.86,11.9 VIA.3
GND  (via drill 0.85)
  Top 0.152: v84.1,58.1 88.2,58.1 v88.3,58.2 | v91.4,57.9 94.7,57.9 v95.7,58.9 | v59,55.2 60.5,53.7 v60.5,53.6 | v60.8,47.4 60.4,47 v58.5,47 | C6.- 51.4,78.95 v51.4,77 | v54.5,77 53.23,75.73 53.23,74.2 | v46.3,96.9 v46.3,99.4 | v46.3,102.3 v46.3,104.5 | v46.5,106.3 51.4,101.4 51.4,101.37 | Q8.2 18.95,60.9 v22,60.9 | 20,57.7 19.3,57 v18.2,57 | v33.1,57.7 35.7,57.7 v37.7,59.7 | v79.9,52.6 77.98,50.69 77.98,50.02 77.69,50.02 75.8,51.9 v75.8,52.5 | v80,55 73.4,55 v73.2,55.2 | v77.7,53.9 77.7,52.2 v79.7,50.2 | 45.2,22.2 46,23 v46.4,23 | C4.- 37.81,14.91 v37.6,14.7 | v43.9,14.3 45.74,16.14 | v8.9,16.33 5.67,16.33 v5.6,16.4
  Top 0.61: 53.23,78.1 C6.- 56.6,77.41 v56.6,76.9 | 53.23,78.1 53.23,74.2 53.23,71.93 C7.- | U$1.2 63.81,27.52 64.5,28.2 66,28.2 | 66,28.2 66.36,27.85 U$1.4 | 67.8,28.2 69.07,28.2 R3.2 69.75,25.41 C3.2 69.96,25.2 C23.2 73,25.9 73,26.4 | 67.8,28.2 66,28.2 | 74.4,61.23 Q3.2 75.42,60.22 | C9.2 88.75,45.95 v88.5,46.2 | C12.2 69.23,53.62 69.8,53.05 69.8,51.2 70.98,50.02 2.3 77.98,50.02 78.45,49.55 | 1.3 78.75,49.25 78.45,49.55 | 93.9,29.4 96.3,27 T2.2 98.29,28.46 98.29,28.9 | R18.1 98.29,32.36 98.29,28.9 | T3.2 87.85,28.45 88.8,29.4 v93,29.4 93.9,29.4 | 93.9,29.4 93.9,33.3 92.9,34.3 89.61,34.3 T1.2 | R11.2 74.4,35.5 73,34.1 73,27.9 | 73,27.9 73,26.4 | 98.29,28.9 99,28.19 v99,27.7 | 75.42,60.22 75.53,60.1 v76.6,60.1 | PWR.C 78.55,23.15 75.3,26.4 73,26.4 | C20.2 15.06,52.44 16,51.5 16,50.1 17.02,49.09 4.3 22.6,49.09 | 34.05,22.9 C2.2 34.05,19.95 35.1,18.9 45.2,18.9 | 34.05,22.9 34.05,23.82 34.8,24.57 | 34.8,24.57 IC2.1 | C22.2 32.9,25.8 34.8,25.8 34.8,24.57 | C14.2 44.93,35.52 | 44.93,35.52 47.67,32.77 | 47.67,32.77 C5.- 47.77,35.17 48.7,36.1 55.67,36.1 C15.1 | C1.2 47.13,32.23 | 47.13,32.23 47.67,32.77 | R32.1 26.61,27.9 | 26.61,27.9 26.61,25.14 T5.2 | T4.2 17.69,31.8 21.9,31.8 21.9,28.7 22.7,27.9 | 22.6,27.9 22.7,27.9 | 22.7,27.9 26.61,27.9 | T6.2 18.65,27 20.5,27 | 22.6,27.9 21.7,27 20.5,27 | 22.6,27.9 23.7,26.8 v24.2,26.8 | 20.5,27 v20.5,27.1 | 45.74,16.14 45.2,16.68 45.2,18.9 | 47.13,32.23 45.2,30.3 45.2,25.4 | 45.2,18.9 45.2,22.2 45.2,25.4 | R25.2 4.98,30.4 3.2,30.4 3.2,18.8 v5.6,16.4 | v98.7,19.8 98.9,19.6 98.9,14.1 | 98.9,14.1 v98.9,7.8 98.9,7.5 | v98.8,14 98.9,14.1 | Q8.2 18.53,59.17 20,57.7 v22.9,57.7 | v22.9,57.7 v27.6,57.7
  Top 0.61: v37.7,59.7 37.7,62.29 Q6.2 | 75.42,60.22 75.42,60.02 73.4,58 v73.4,56.9 | 78.45,49.55 77.4,48.5 v76.2,48.5 | IC5.2 56.34,52.54 v59,55.2 | IC5.2 51.76,52.3 v59.1,52.3 | IC5.2 55.96,52.54 v58.8,49.7 | IC5.2 57.06,47 v58.5,47 | 53.23,78.1 v48.5,78.1 | C7.- 52.11,71.89 v49.3,74.7 | C7.- 55.48,74.1 v56.6,74.1 | 51.4,101.37 MAIN.2 | 22.6,49.09 23.39,49.09 23.5,49.2 25.5,49.2 26.1,48.6 29.5,48.6 3.3 | v68.8,58.2 68.9,58.1 76.5,58.1 | 76.5,58.1 81.1,58.1 v81.2,58 | v93.2,59.4 92.2,60.4 90.44,60.4 Q1.2 v92.5,61.8 95.1,61.8 95.8,61.1 95.7,61 v95.7,58.9 | 76.5,58.1 76.6,58 v76.6,56.7 | 34.05,22.9 33,22.9 v32.8,22.7 | 73,27.9 72.6,27.5 v72.1,27.5 | 67.8,28.2 v67.8,25.5 | v46,25.7 45.5,25.7 45.2,25.4 | 22.6,49.09 v22.6,57.4 v22.9,57.7 | v43.7,36.9 43.7,36.75 44.93,35.52
  Top 0.813: C17.2 32.8,44.22 32.8,38.7 34,37.5 44.54,37.5 C14.2
  Bottom 0.152: 84.4,59.4 84.1,59.1 v84.1,58.1 | v88.3,58.2 91.1,58.2 v91.4,57.9 | v60.5,53.6 60.5,47.7 v60.8,47.4 | v51.4,77 v54.5,77 | v46.3,104.5 46.3,106.1 v46.5,106.3 | v22,60.9 22.6,60.3 v22.6,57.4 | v18.2,57 26.9,57 v27.6,57.7 | 37,57.7 37.7,58.4 v37.7,59.7 | v75.8,52.5 76.5,52.5 76.5,51.9 78.8,49.6 79.1,49.6 v79.7,50.2 | v79.9,52.6 80,52.7 v80,55 | v73.2,55.2 76.4,55.2 v77.7,53.9 | v46.4,23 45.2,24.2 46.2,25.2 46.2,25.5 | v37.6,14.7 43.5,14.7 v43.9,14.3 | v5.6,16.4 8.83,16.4 v8.9,16.33
  Bottom 0.61: v76.6,60.1 76.8,60.3 | v46.3,102.3 v46.3,99.4 | v46.3,96.9 46.3,80.3 v48.5,78.1 48.5,75.5 v49.3,74.7 | v49.3,74.7 56,74.7 v56.6,74.1 v56.6,76.9 | v49.3,74.7 49.3,57.6 49.3,56.2 50.85,54.65 54.65,50.85 v58.5,47 48.4,36.9 v43.7,36.9 | v73.4,56.9 73.3,56.9 71.8,58.4 69,58.4 v68.8,58.2 55,58.2 54.5,57.7 | v81.2,58 82.6,59.4 84.4,59.4 v93.2,59.4 | v32.8,22.7 28.3,22.7 v24.2,26.8 | v5.6,16.4 9.1,16.4 18.9,6.6 40.5,6.6 40.9,6.6 | v98.7,19.8 98.7,27.4 v99,27.7 | v67.8,25.5 46.2,25.5 v46,25.7 | v88.5,46.2 92.9,50.6 95.7,53.4 v95.7,58.9 93.5,61.1 78.5,61.1 78.5,58.6 v76.6,56.7 76.6,48.9 v76.2,48.5 | v98.9,7.8 93.5,2.4 62.2,2.4 61.2,1.4 44.1,1.4 44.1,3.03 PINHEADER.5
  Bottom 0.813: 49.2,57.7 37,57.7 v33.1,57.7 v27.6,57.7 v22.9,57.7 | 49.2,57.7 49.3,57.6 | 49.2,57.7 54.5,57.7 56.5,57.7 v59,55.2 | v59.1,52.3 53.2,52.3 50.85,54.65 | v58.8,49.7 55.8,49.7 54.65,50.85 | v93,29.4 93,38.7 97.2,42.9 97.2,47.1 96.9,47.4 95.8,47.4 95.1,48.1 95.1,49.1 93.6,50.6 92.9,50.6 | 40.9,6.6 43.4,6.6 44.9,8.1 45.83,7.17 PINHEADER.5 42.34,4.76 40.5,6.6
  pour Bottom (isolate 0.406): 0.4,62.3 100.8,62.3 103.9,59.2 103.9,3.9 101.1,1.1 100.2,0.2 0.4,0.2
  pour Bottom (isolate 0.406): 43,107.3 43,61.9 43.4,61.5 59.2,61.5 59.8,62.1 59.8,91.6 58.6,92.8 57.8,93.6 55.2,93.6 53.7,95.1 53.7,104.5 53.7,107.3
  pour Top: 47.2,85.3 47.2,69 48.3,67.9 48.6,67.6 58,67.6 58,84.4 57.1,85.3
  pour Top: 53.5,107.4 53.5,96.2 52.6,95.3 43.9,95.3 43.6,95.6 43.6,106.6 44.5,107.5 53.4,107.5
M1A  (via drill 0.85)
  Top 0.61: 2.1 73.47,46.37 73.6,46.23 73.6,44.6
  Top 1.016: M1B.2 85.58,12.4 v84.7,12.4 82.4,12.4 81.7,13.1 81.7,22.5 79.09,25.11 R14.1 | 73.47,46.37 73.3,46.2 v72.7,46.2
  Bottom 1.016: v72.7,46.2 74.4,46.2 75.4,47.2 82.7,47.2 84.7,45.2 84.7,27.4 81.8,24.5 81.8,15.3 v84.7,12.4
M1B  (via drill 0.85)
  Top 0.61: 1.1 83.6,52.97 v83.6,54.5 | v86.5,35.9 83.64,35.9 R13.2 | M1A.2 66.09,10.7 v69.7,10.7
  Bottom 0.813: 86.4,9.7 70.7,9.7
  Bottom 1.016: v83.6,54.5 86.5,51.6 v86.5,35.9 86.5,18.6 89.4,18.6 90.1,17.9 90.1,13.4 86.4,9.7 | 70.7,9.7 v69.7,10.7
M2A  (via drill 0.85)
  Top 0.61: 3.1 28.18,52.6 v26.9,52.6 | R27.2 10.87,32.63 10.4,33.1 3,33.1 1.9,32 1.9,11.3 4.2,9 27.57,9 29.43,10.87 M2A.2
  Top 1.016: 29.43,10.87 29.4,10.9 v21.6,10.9
  Bottom 0.813: v21.6,10.9 21.3,10.6 18.4,10.6 3.2,25.8 3.2,52.9 4.4,54.1 10.45,54.1 10.45,44.05 11.7,42.8 26.9,42.8 29.2,45.1 29.2,52.2 27.3,52.2 v26.9,52.6
M2B  (via drill 0.85)
  Top 0.61: R28.1 11.57,18.51 M2B.2 | v23,46.7 22.84,46.55 4.1
  Top 1.016: v9.1,11.4 M2B.2
  Bottom 0.813: v23,46.7 20,46.7 18,44.7 13,44.7 12.2,45.5 12.2,53.5 12.3,53.6 12.3,54.9 11.9,55.3 3.3,55.3 1.7,53.7 1.7,16.4 6.7,11.4 v9.1,11.4
N$1
  Top 0.61: R6.2 74.92,16.84 PWR.A
N$2
  Top 0.61: IC2.5 41.7,29.85 C1.1
N$3
  Top 0.61: R1.1 36.1,34.32 | 36.1,34.32 34.52,34.32 R2.2 | IC2.7 36.16,34.27 36.1,34.32
N$4
  Top 0.61: IC2.2 36.16,21.41 C2.1 36.05,20.4 36.25,20.2 42,20.2 42,25.5 39.7,27.8 38.3,27.8 37.42,28.68 IC2.6 37.42,31.73 37.8,32.1 39,32.1 40.44,33.54 R1.2
N$5
  Top 0.61: U$1.3 65.08,24.52 66.21,23.39 C3.1
N$6
  Top 0.61: R22.1 33.06,62.27 Q6.1
N$7
  Top 0.61: L1.1 58.72,23.6 D2.A 62.55,22.09 U$1.1
N$8
  Top 0.61: R5.1 61.34,33.5 62.54,32.3 62.54,31.36 U$1.8
N$9
  Top 0.61: 84.82,79.3 Q4.1
  Top 0.813: R7.1 84.82,79.3
N$10
  Top 0.61: R8.1 Q1.1
N$11
  Top 0.61: R4.1 70.56,31.17 | 70.56,31.17 R3.1 69.75,30.1 66.6,30.1 66.36,30.35 U$1.5 | 70.39,31.35 70.56,31.17
N$12
  Top 0.61: R8.2 81.55,64.6 95.7,64.6 98,62.3 98,55.6 87,55.6 86.5,55.1 86.5,48.93 85.55,47.98 1.4
N$13
  Top 0.61: 81.62,82.6 98.5,82.6 | 99.1,82 99.1,54.1 88,54.1 87.43,53.53 87.43,51.65 88.57,50.52 1.7
  Top 0.813: R7.2 81.62,82.6 | 98.5,82.6 99.1,82
N$14
  Top 0.61: D4.C 82.92,43.74 C10.2 83.16,40.9 86.2,40.9 86.2,39 85.9,39.3 D3.A
N$15
  Top 0.61: R10.1 69.4,61.19 Q3.1
N$16
  Top 0.61: Q2.1
  Top 0.813: R9.1 Q2.1
N$17
  Top 0.61: R10.2 64.93,64.03 63.7,62.8 63.7,59.2 64,58.9 64.4,58.9 64.4,56.9 65.2,56.1 69.2,56.1 70.9,54.4 70.9,52.1 71.72,51.29 2.4
N$18
  Top 0.61: R9.2 63.69,81.83 62.7,80.84 62.7,66.9 61.4,65.6 61.4,58.8 62.3,57.9 62.3,47.3 62.76,47.3 64.2,48.75 2.7
N$19
  Top 0.61: T1.1 89.61,31.5 90.01,31.1 91.19,31.1 R16.1
N$20
  Top 0.152: 66.3,39 65.1,39 64.9,39.2 63.3,39.2 63.1,39.4
  Top 0.61: C13.2 73.38,44.6 71.7,44.6 71.7,41.6 72.2,41.1 75,41.1 76.21,39.89 D6.A 75.64,38.3 74.5,38.3 73.9,37.7 73.9,36.8 66.9,36.8 66.3,37.4 66.3,39 66.3,45.72 D7.C
N$21
  Top 0.61: M1B.1 86.45,6.13 R20.2 66.88,6.13 M1A.1 66.18,5.32 66.6,4.9 | M2B.1 11.96,5.6 M2A.1
  Top 1.016: M2A.1 33.57,1.6 63.3,1.6 66.6,4.9
N$22
  Top 0.61: R14.2 80.2,29.7 80.9,29 80.9,28 81.8,27.1 81.86,27.16 R15.1 85.46,27.16 T3.3
N$24
  Top 0.61: R12.2 80.7,35.5 81,35.2 81,34 82.34,32.66 R13.1 86.3,32.66 T1.3
N$25
  Top 0.61: 33.05,79.69 Q5.1
  Top 0.813: R21.1 33.05,79.69
N$26
  Top 0.61: R22.2 28.43,64.6 39,64.6 40.1,63.5 40.1,54.7 39.8,54.4 33.4,54.4 31.5,52.5 31.5,47.9 30.8,47.2 29.77,47.2 3.4
N$27
  Top 0.61: T2.3 92.15,26.05 92.01,26.19 R19.1 91.6,26.3 87.95,26.3 T3.1
N$28
  Top 0.61: T2.1 100.2,25.1 101.1,26 101.1,33.8 100.8,34.1 96.38,34.1 95.54,33.26 R17.1
N$30
  Top 0.61: R21.2 40.67,82.53 41.3,81.9 41.3,54.1 40.5,53.3 33.9,53.3 32.5,51.9 32.5,50.3 32.8,50 34.22,50 3.7
N$31
  Top 0.61: D10.C C18.2 | C18.2 | D9.A 29.77,39.88 C18.2
N$32
  Top 0.61: Q8.1 R24.1
N$33
  Top 0.61: 10.25,79.82 R23.1
  Top 0.813: Q7.1 10.25,79.82
N$34
  Top 0.61: R24.2 9.19,64.3 6.8,64.3 6.8,55.8 8,54.6 15.2,54.6 17.3,52.5 17.3,50.69 17.63,50.36 4.4
N$35
  Top 0.61: R23.2 6.31,83.19 6.2,83.3 5.4,82.5 5.4,49.5 7.1,47.8 13.81,47.8 4.7
N$36
  Top 0.61: D13.C 9.6,43.82 D12.A 10.02,40.16 C21.2
N$37
  Top 0.61: T6.3 15.79,24.69 15.1,24 12.46,24 R29.1 9.75,24.15 9.69,24.21 R28.2
N$38
  Top 0.61: R26.2 8.77,29.79 R27.1 14.09,29.79 15.25,30.95 T4.3
N$39
  Top 0.61: R30.1 17.92,30.33 T4.1
N$40
  Top 1.016: T6.1 20.98,24.44 R33.1 24.15,23.93 T5.3
N$41
  Top 0.61: T5.1 28.12,23.22 28.2,23.3 28.2,31.2 27.8,31.6 23.8,31.6 R31.1
N$45
  Top 1.016: 1A.C 91.04,100.48 1B.A 91.3,97.4 90.97,97.07 | 90.5,96.6 90.97,97.07 | 90.97,97.07 R34.1
N$46
  Top 1.016: R35.1 15.53,99.82 B2.C 19.93,100.3 2A.A
PWM1  (via drill 0.85)
  Top 0.61: R15.2 81.7,30 81.4,30.3 81.4,31.6 80.7,32.3 79.75,32.3 R12.1 R11.1 76.04,29.06 v76.1,29
  Bottom 0.61: VIA.2 53.5,4.81 PINHEADER.2
  Bottom 0.813: VIA.2 53.5,11.2 54.9,12.6 75.9,12.6 77.5,14.2 77.5,27.6 v76.1,29
PWM2
  Top 0.61: R29.2 9.81,26.99 9.69,27.11 R26.1 8.39,27.33 5.6,27.33 | 5.6,27.33 R25.1 | PINHEADER.4 48.37,7.53 46.3,9.6 34.5,9.6 33.8,10.3 33.8,13.9 32.6,13.9 32.5,14 14.8,14 13.6,15.2 13.6,20.1 10.9,22.8 7,22.8 5.6,24.2 5.6,27.33
TIMER  (via drill 0.85)
  Top 0.61: C13.1 78.3,42.5 v79.25,41.55 79.7,41.1 79.7,39.6 80.3,39 80.44,39.14 C10.1 | 24.4,39.6 23.5,40.5 23.4,40.4 17.5,40.4 17,39.9 17,35.4 10.5,35.4 10,35.9 10,37.86 C21.1 8.36,36.5 v7.1,36.5 | 24.4,39.6 25.2,38.8 25.2,37.8 27.59,37.8 C18.1 | 24.4,39.6 24.4,39.1 v24,38.7 | IC2.3 37.42,22.58 38.1,21.9 v39,21.9
  Bottom 0.813: v7.1,36.5 9.3,38.7 12.5,38.7 v24,38.7 34.6,38.7 39,34.3 | v39,21.9 39,34.3 | 39,34.3 72,34.3
  Bottom 1.016: 72,34.3 v79.25,41.55
VB1
  Top 0.61: 1.8 93.03,51.79 C8.2 | D3.C 93.73,39.9 D1.C
  Top 1.016: D1.C 97.4,40.13 97.4,45.8 99.5,45.8 101,47.3 101,52.7 100.7,53 93.8,53 93.36,52.56 C8.2 93.66,51.75
VB2
  Top 0.61: 2.8 69.03,47.48 | 69.03,47.48 69.5,47.48 69.5,44.7 69.03,44.23 | D6.C 71.49,38.55 C11.2 68.81,38.6 67.4,38.6 67.4,41.8 68.53,42.93 D5.C 68.53,43.73 69.03,44.23 | 69.03,44.23 69.03,47.48
VB3
  Top 0.61: 3.8 37.2,51.22 C16.2 | D9.C 39.04,40.64 D8.C
  Top 0.813: C16.2 40.85,51.15 41.9,50.1 41.9,41.5 40.74,40.34 D8.C
VB4
  Top 0.61: D11.C 14.75,42.52 | 4.8 14.42,45.95 D12.C 14.42,42.83 14.73,42.52 14.75,42.52 | C19.2 14.75,42.52
VCC  (via drill 0.85)
  Top 0.61: 67.67,51.3 2.5 66.92,51.29 65.8,52.4 66.19,52.79 C12.1 65.11,54.7 v64.7,54.7 | 1.5 90.58,47.98 90.75,47.8 C9.1 90.75,44.54 90.76,44.53 D1.A | R4.2 67.6,34.42 67.6,35.4 66.4,35.4 64.6,37.2 64.6,41.4 64.6,43.7 64.26,43.7 D5.A | C23.1 72.3,22.3 R6.1 71.8,19.91 69.7,19.91 | D2.C 66.81,19.91 69.7,19.91 | R19.2 91.56,23.5 89.3,23.5 83.6,23.5 83.6,16.9 85.2,15.3 92.2,15.3 92.2,8 81.6,8 79.33,10.27 78.51,10.27 | C17.1 35.42,44.84 36.9,44.84 | D8.A 36.8,44.74 36.9,44.84 | 3.5 34.38,47.3 37.1,47.3 37.1,45.04 36.9,44.84 | 4.5 12.24,50.36 11.29,51.31 C20.1 8.46,52.44 v8.4,52.5 | 34.9,29.1 33.4,29.1 C22.1 32.3,28.4 29.7,28.4 29.7,22.8 27.99,21.09 27.6,21.09 R33.2 | 34.9,29.1 34.9,29.84 IC2.8 34.88,31.29 34.9,31.3 34.2,32 32.5,32 31.6,32.9 R2.1 32.4,35.04 32.4,36.8 31.4,37.8 30.4,37.8 30.3,37.9 29.5,37.1 29.5,36.6 29,36.1 20.85,36.1 20.48,36.48 D11.A | IC2.4 38.8,24.75 38.8,25.8 37.7,26.9 36.2,26.9 34.9,28.2 34.9,29.1 | 69.7,19.91 69.2,19.41 v69.2,16.7
  Top 0.813: D8.A 37.98,46.1 v36.1,46.1
  Top 1.016: R20.1 78.51,9.77 78.51,10.27 74.58,14.2 72.1,14.2 71.8,14.5 71.8,19.91 | C4.+ 55.48,14.7 64.3,14.7 65.79,16.19 D2.C | v27.6,18.3 27.6,21.09 | 64.6,41.4 63.4,40.2 v63.4,39.5 | 89.3,23.5 89.3,21.1 v88.8,20.6 | v92.3,47 92.3,46.19 D1.A | 20.48,36.48 21.07,36.48 v21.4,36.8
  Bottom 0.61: 9.9,41.5 6.8,41.5 5,39.7 5,52 5.5,52.5 v8.4,52.5
  Bottom 0.813: v69.2,16.7 29.2,16.7 v27.6,18.3 | 69.9,28.4 74.9,33.4 | v36.1,46.1 31.5,41.5 9.9,41.5 | 21,36.4 10.6,36.4 8.1,33.9 5,33.9 5,39.7
  Bottom 1.016: v69.2,16.7 69.9,17.4 69.9,28.4 | 74.9,33.4 78.9,33.4 82.8,37.3 82.8,44.2 69.2,44.2 66.75,46.65 | 66.75,46.65 66.05,47.35 66.05,42.15 v63.4,39.5 | v88.8,20.6 89.5,21.3 89.5,44.2 v92.3,47 | v21.4,36.8 21,36.4 | 66.75,46.65 69.4,49.3 69.9,49.3 70.2,49.6 70.2,54 69.2,55 65,55 v64.7,54.7
(copper drawn outside any net)
  shapes: Bottom area x58, Top area x181